# Altium schematic sheet Color_Sensor.SchDoc
size A
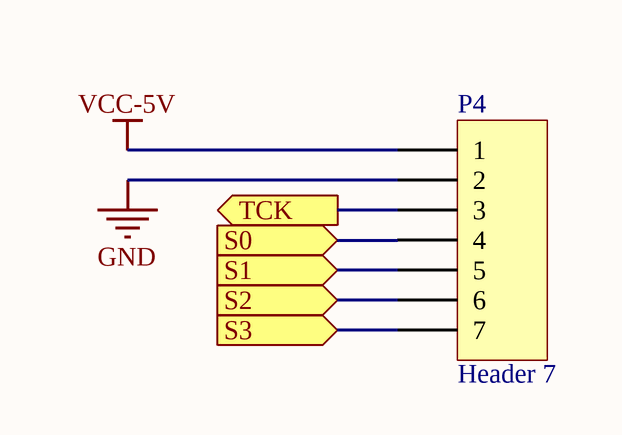
[diagram p0: Color_Sensor.SchDoc]

## Parts
P4  Header 7  [HDR1X7]

## Ports
S0 (in), S1 (in), S2 (in), S3 (in), TCK (out)

## Nets
GND: P4.2
VCC-5V: P4.1
S0: P4.4 ; port S0
S1: P4.5 ; port S1
S2: P4.6 ; port S2
S3: P4.7 ; port S3
TCK: P4.3 ; port TCK

## Library data of the parts
P4 = Header 7: Header, 7-Pin; LatestRevisionDate: 17-Jul-2002; LatestRevisionNote: Re-released for DXP Platform.; Publisher: Altium Limited